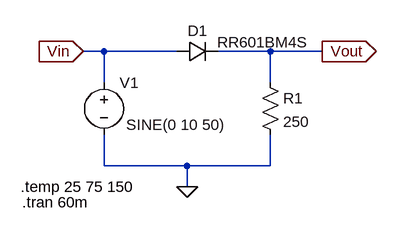
[diagram p0: schematic Draft1 Exercise 4.asc]
Draft1 Exercise 4.asc, the LTspice schematic file:
Version 4
SHEET 1 880 680
WIRE 32 80 0 80
WIRE 144 80 32 80
WIRE 288 80 208 80
WIRE 368 80 288 80
WIRE 32 128 32 80
WIRE 288 128 288 80
WIRE 32 256 32 208
WIRE 160 256 32 256
WIRE 288 256 288 208
WIRE 288 256 160 256
WIRE 160 288 160 256
FLAG 160 288 0
FLAG 0 80 Vin
IOPIN 0 80 In
FLAG 368 80 Vout
IOPIN 368 80 Out
SYMBOL voltage 32 112 R0
WINDOW 3 34 81 Left 2
WINDOW 123 0 0 Left 0
WINDOW 39 0 0 Left 0
SYMATTR InstName V1
SYMATTR Value SINE(0 10 50)
SYMBOL diode 144 96 R270
WINDOW 0 32 32 VTop 2
WINDOW 3 46 132 VBottom 2
SYMATTR InstName D1
SYMATTR Value RR601BM4S
SYMBOL res 272 112 R0
SYMATTR InstName R1
SYMATTR Value 250
TEXT -96 288 Left 2 !.temp 25 75 150
TEXT -94 312 Left 2 !.tran 60m

The netlist it stands for:
* Draft1 Exercise 4.asc
V1 Vin 0 SINE(0 10 50)
D1 Vin Vout RR601BM4S
R1 Vout 0 250
.model D D
.lib standard.dio
.temp 25 75 150
.tran 60m
.backanno
.end

* Results of the author's LTspice run, read from the files saved beside the schematic
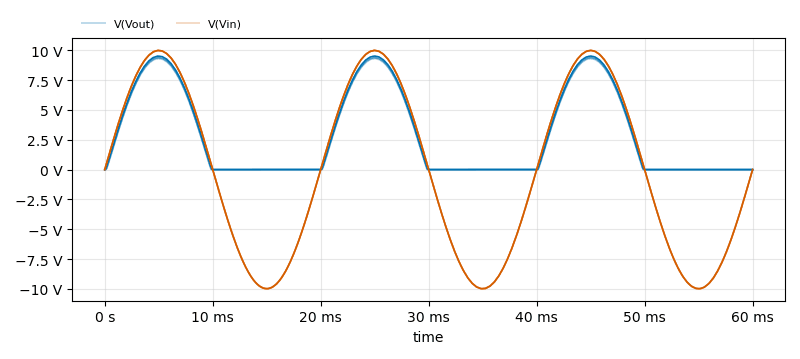
[diagram p1: Transient Analysis of Draft1 Exercise 4.asc, plotted from the saved traces]
* Transient Analysis, 3 runs:
*   V(Vout) [temp=25°C]: min -109.7 µV, max 9.314 V, average 2.856 V, rms 4.574 V, last 97.6 µV
*   V(Vout) [temp=75°C]: min -123 µV, max 9.396 V, average 2.899 V, rms 4.628 V, last 133.8 µV
*   V(Vout) [temp=150°C]: min -2.257 mV, max 9.525 V, average 2.963 V, rms 4.71 V, last 370.4 µV
*   V(Vin) [temp=25°C]: min -9.984 V, max 10 V, average -104 µV, rms 7.069 V, last 0 V
*   V(Vin) [temp=75°C]: min -9.999 V, max 9.999 V, average -147.9 µV, rms 7.069 V, last 0 V
*   V(Vin) [temp=150°C]: min -9.993 V, max 10 V, average 12.28 µV, rms 7.07 V, last 0 V